# EAGLE schematic UAV_ARM (EAGLE 7.1.0)
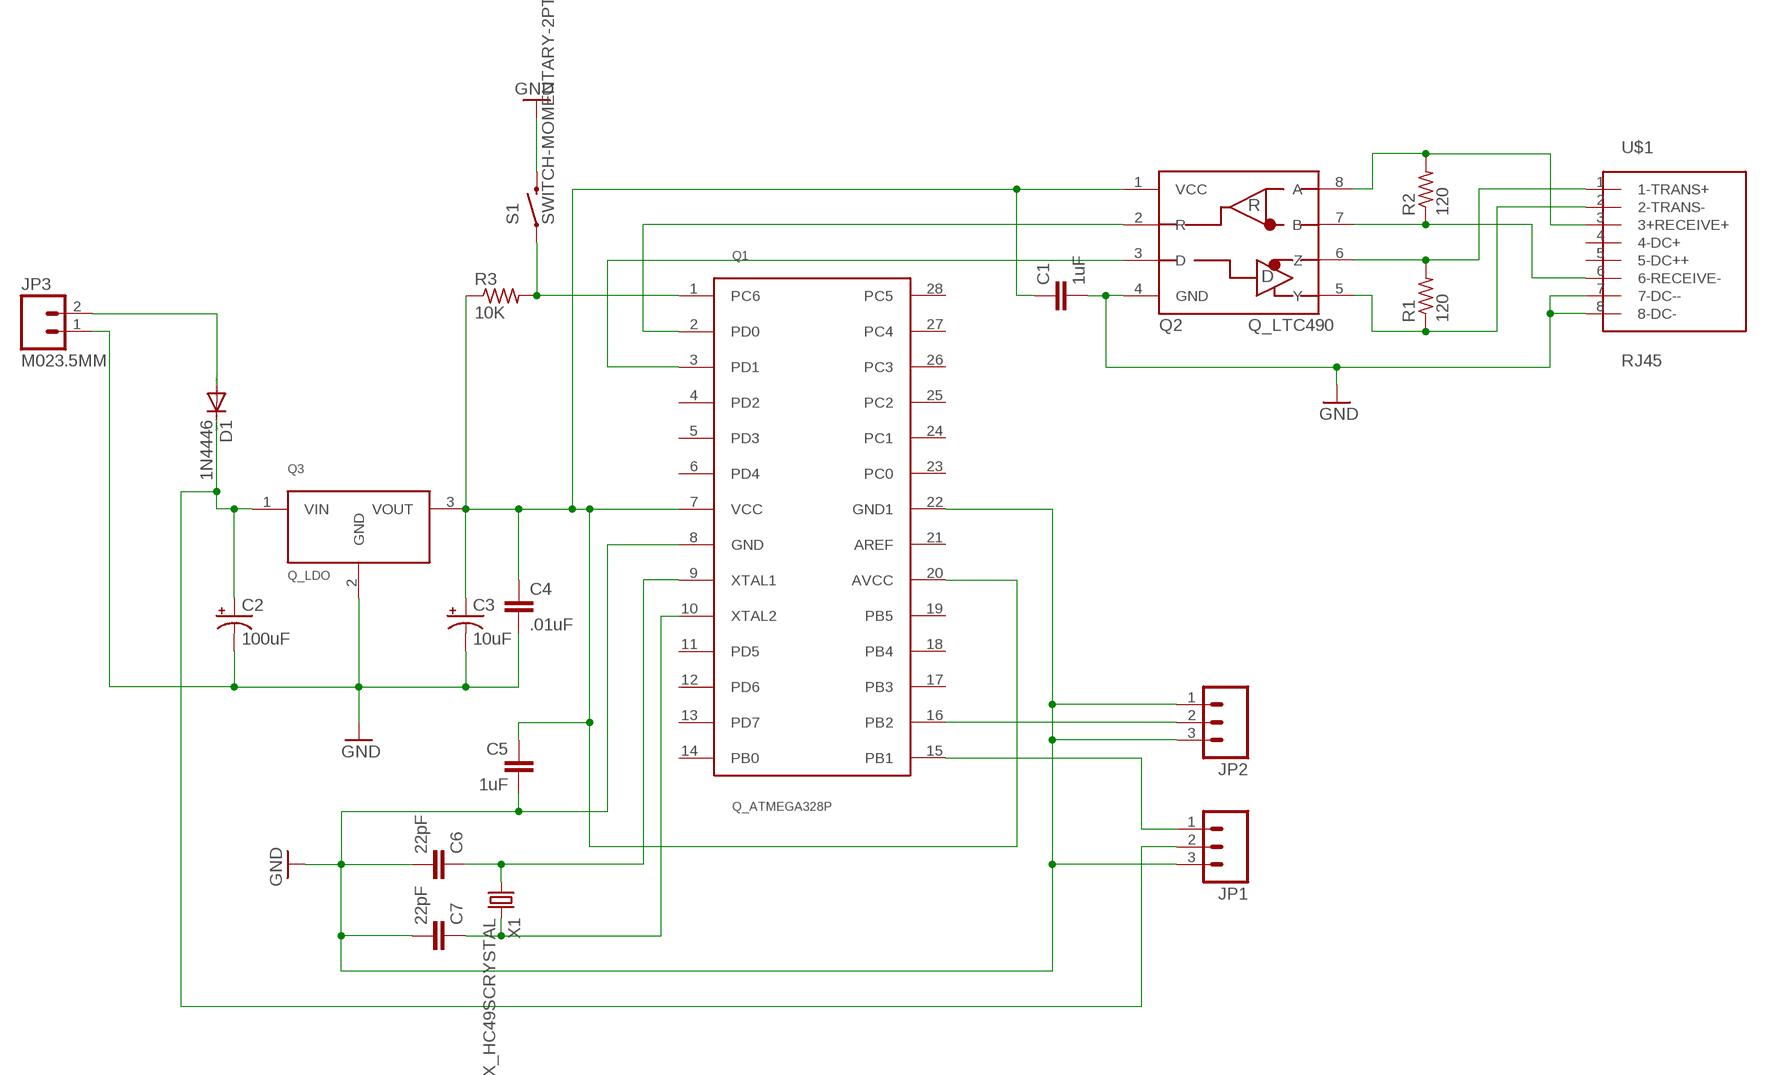
[diagram p0: schematic, sheet 1]

## Parts
C1  1uF  CAPKIT  [CAP-PTH-SMALL-KIT]
C2  100uF  CAP_POLPTH1  [CPOL-RADIAL-100UF-25V]
C3  10uF  CAP_POLPTH2  [CPOL-RADIAL-10UF-25V]
C4  .01uF  CAPKIT  [CAP-PTH-SMALL-KIT]
C5  1uF  CAPKIT  [CAP-PTH-SMALL-KIT]
C6  22pF  CAPKIT  [CAP-PTH-SMALL-KIT]
C7  22pF  CAPKIT  [CAP-PTH-SMALL-KIT]
D1  1N4446  [DO35-10]
JP1  M03POLAR  [MOLEX-1X3]
JP2  M03POLAR  [MOLEX-1X3]
JP3  M023.5MM  [SCREWTERMINAL-3.5MM-2]
Q1  Q_ATMEGA328P  [DIP28]
Q2  Q_LTC490  [DIP8]
Q3  Q_LDO  [TO-220]
R1  120  R-US_0204/7  [0204/7]
R2  120  R-US_0204/7  [0204/7]
R3  10K  R-US_0204/7  [0204/7]
S1  SWITCH-MOMENTARY-2PTH  [TACTILE-PTH]
U$1  RJ45  [RJ45-CAT5E]
X1  X_HC49SCRYSTAL  [HC-49]

## Nets
GND: C1.2 C2.2(-) C3.2(-) C4.2 C5.2 C6.2 C7.2 JP1.3 JP2.1 JP2.3 JP3.1 Q1.8(GND) Q1.22(GND1) Q2.4(GND) Q3.2(GND) S1.3 U$1.7(7-DC--) U$1.8(8-DC-)
N$1: Q2.8(A) R2.2 U$1.3(3+RECEIVE+)
N$2: Q2.7(B) R2.1 U$1.6(6-RECEIVE-)
N$3: Q2.5(Y) R1.1 U$1.2(2-TRANS-)
N$4: Q2.6(Z) R1.2 U$1.1(1-TRANS+)
N$5: C2.1(+) D1.C JP1.2 Q3.1(VIN)
N$6: C1.1 C3.1(+) C4.1 C5.1 Q1.7(VCC) Q1.20(AVCC) Q2.1(VCC) Q3.3(VOUT) R3.1
N$7: Q1.3(PD1) Q2.3(D)
N$8: Q1.2(PD0) Q2.2(R)
N$9: Q1.1(PC6) R3.2 S1.1
N$10: C6.1 Q1.9(XTAL1) X1.P$1
N$11: C7.1 Q1.10(XTAL2) X1.P$2
N$13: JP2.2 Q1.16(PB2)
N$14: JP1.1 Q1.15(PB1)
N$15: D1.A JP3.2
Unconnected: Q1.4(PD2) Q1.5(PD3) Q1.6(PD4) Q1.11(PD5) Q1.12(PD6) Q1.13(PD7) Q1.14(PB0) Q1.17(PB3) Q1.18(PB4) Q1.19(PB5) Q1.21(AREF) Q1.23(PC0) Q1.24(PC1) Q1.25(PC2) Q1.26(PC3) Q1.27(PC4) Q1.28(PC5) U$1.4(4-DC+) U$1.5(5-DC++)

## Library data of the parts
C1 C4-C7 = SparkFun-Capacitors:CAP: Capacitor Standard 0603 ceramic capacitor, and 0.1" leaded capacitor.
C2 C3 = SparkFun-Passives:CAP_POL: Capacitor Polarized These are standard SMD and PTH capacitors. Normally 10uF, 47uF, and 100uF in electrolytic and tantalum varieties. Always verify the external diameter of the through hole cap, it varies with capacity, voltage, and manufacturer. The EIA devices should be standard.
D1 = diode:1N4446: DIODE high speed (Philips)
JP1 JP2 = SparkFun-Connectors:M03: Header 3 Standard 3-pin 0.1" header. Use with straight break away headers (SKU : PRT-00116), right angle break away headers (PRT-00553), swiss pins (PRT-00743), machine pins (PRT-00117), and female headers (PRT-00115). Molex polarized connector foot print use with SKU : PRT-08232 with associated crimp pins and housings.
JP3 = SparkFun-Connectors:M02: Standard 2-pin 0.1" header. Use with - straight break away headers ( PRT-00116) - right angle break away headers (PRT-00553) - swiss pins (PRT-00743) - machine pins (PRT-00117) - female headers (PRT-00115) Molex polarized connector foot print use with: PRT-08233 with associated crimp pins and housings. 2.54_SCREWTERM for use with PRT-10571. 3.5mm Screw Terminal footprints for PRT-08084 5mm Screw Terminal footprints for use with PRT-08432
Q1 = MRDT-2014-All:Q_ATMEGA328P: ATMEGA 328P in 28PIN PDIP package
Q2 = MRDT-2014-All:Q_LTC490: IC, RS422-RS485 DRVR
Q3 = MRDT-2015-General:Q_LDO: LDO with fixed ouput voltage
R1-R3 = resistor:R-US_: RESISTOR, American symbol
S1 = SparkFun-Electromechanical:SWITCH-MOMENTARY-2: Various NO switches- pushbuttons, reed, etc
U$1 = MRDT-2014-All:RJ45
X1 = MRDT-2014-All:X_HC49SCRYSTAL: CRYSTAL METAL CAN, 16MHZ, 18PF, HC-49/US

## Net classes
0 default: clearance 0.205 mm